# Altium schematic sheet E73-2G4M04S_breakout_sch.SchDoc: E73-2G4M04S Breakout Board
size A4; Author: Zisis Adamos; Engineer: Zisis Adamos; Revision: 1.0
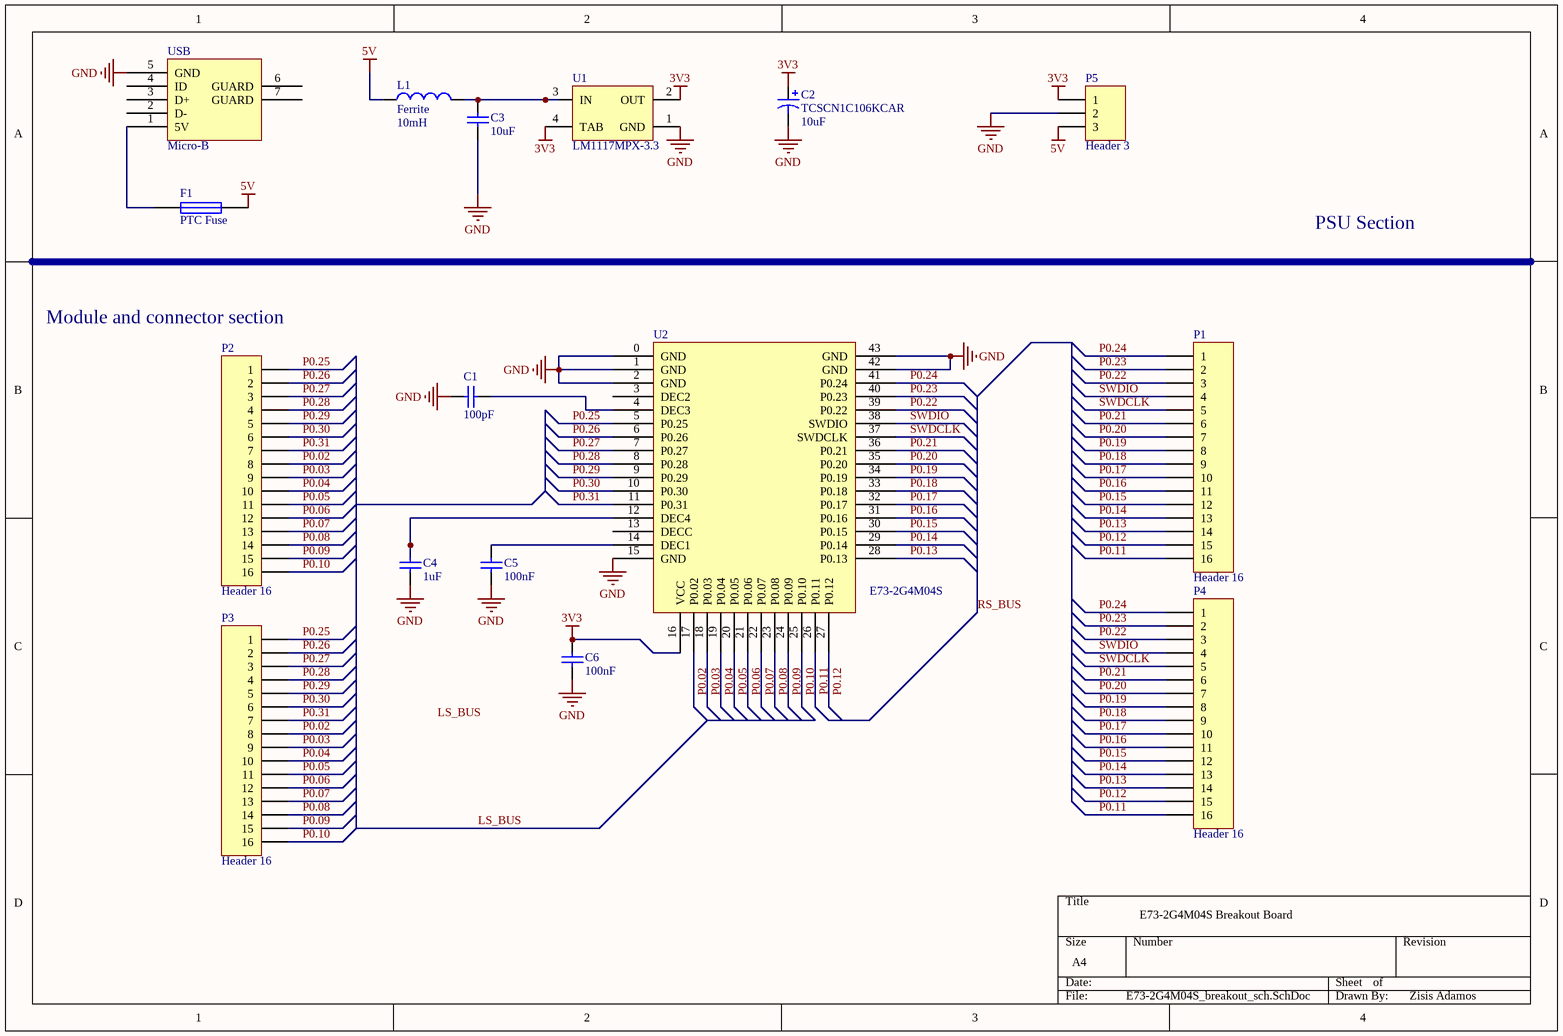
[diagram p0: E73-2G4M04S_breakout_sch.SchDoc]

## Parts
C1  value 100pF  [6-0805_N]  (hidden comment: Cap)
C2  TCSCN1C106KCAR  value 10uF  [C]
C3  value 10uF  [6-0805_N]  (hidden comment: Cap)
C4  value 1uF  [6-0805_N]  (hidden comment: Cap)
C5  value 100nF  [6-0805_N]  (hidden comment: Cap)
C6  value 100nF  [6-0805_N]  (hidden comment: Cap)
F1  PTC Fuse  [1210]
L1  Ferrite  value 10mH  [6-0805_n]
P1  Header 16  [HDR1X16]
P2  Header 16  [HDR1X16]
P3  Header 16  [HDR1X16]
P4  Header 16  [HDR1X16]
P5  Header 3  [HDR1X3]
U1  LM1117MPX-3.3  [MP04A_N]
U2  E73-2G4M04S  [E73-2G4M04S]
USB  Micro-B  [USB_2_MICRO_B]

## Nets
3V3: C2.1 C6.1 P5.1 U1.2(OUT) U1.4(TAB) U2.16(VCC)
5V: F1.2 L1.1 P5.3
GND: C1.1 C2.2 C3.1 C4.2 C5.2 C6.2 P5.2 U1.1(GND) U2.0(GND) U2.1(GND) U2.2(GND) U2.15(GND) U2.42(GND) U2.43(GND) USB.5(GND)
P0.02: P2.8 P3.8 U2.17(P0.02)
P0.03: P2.9 P3.9 U2.18(P0.03)
P0.04: P2.10 P3.10 U2.19(P0.04)
P0.05: P2.11 P3.11 U2.20(P0.05)
P0.06: P2.12 P3.12 U2.21(P0.06)
P0.07: P2.13 P3.13 U2.22(P0.07)
P0.08: P2.14 P3.14 U2.23(P0.08)
P0.09: P2.15 P3.15 U2.24(P0.09)
P0.10: P2.16 P3.16 U2.25(P0.10)
P0.11: P1.16 P4.16 U2.26(P0.11)
P0.12: P1.15 P4.15 U2.27(P0.12)
P0.13: P1.14 P4.14 U2.28(P0.13)
P0.14: P1.13 P4.13 U2.29(P0.14)
P0.15: P1.12 P4.12 U2.30(P0.15)
P0.16: P1.11 P4.11 U2.31(P0.16)
P0.17: P1.10 P4.10 U2.32(P0.17)
P0.18: P1.9 P4.9 U2.33(P0.18)
P0.19: P1.8 P4.8 U2.34(P0.19)
P0.20: P1.7 P4.7 U2.35(P0.20)
P0.21: P1.6 P4.6 U2.36(P0.21)
P0.22: P1.3 P4.3 U2.39(P0.22)
P0.23: P1.2 P4.2 U2.40(P0.23)
P0.24: P1.1 P4.1 U2.41(P0.24)
P0.25: P2.1 P3.1 U2.5(P0.25)
P0.26: P2.2 P3.2 U2.6(P0.26)
P0.27: P2.3 P3.3 U2.7(P0.27)
P0.28: P2.4 P3.4 U2.8(P0.28)
P0.29: P2.5 P3.5 U2.9(P0.29)
P0.30: P2.6 P3.6 U2.10(P0.30)
P0.31: P2.7 P3.7 U2.11(P0.31)
SWDCLK: P1.5 P4.5 U2.37(SWDCLK)
SWDIO: P1.4 P4.4 U2.38(SWDIO)
NetC1_2: C1.2 U2.4(DEC3)
NetC3_2: C3.2 L1.2 U1.3(IN)
NetC4_1: C4.1 U2.12(DEC4)
NetC5_1: C5.1 U2.14(DEC1)
NetF1_1: F1.1 USB.1(5V)

Not connected (* = marked no-connect by the designer): U2 3(DEC2) 13(DECC); USB 2(D-) 3(D+) 4(ID) 6(GUARD) 7(GUARD)

## Buses and harness runs
bus LS_BUS
bus RS_BUS

## Notes on the sheet
- PSU Section
- (near P2) Module and connector section
- Labels drawn without touching a wire or pin: LS_BUS

## Library data of the parts
C1 C3-C6 = Cap: Capacitor; Published: 8-Jun-2000; LatestRevisionDate: 17-Jul-2002; LatestRevisionNote: Re-released for DXP Platform.; PackageReference: RAD-0.3; Publisher: Altium Limited; PackageDescription: Radial Cap, Thru-Hole; 2 Leads; 0.3 in Pin Spacing
C2 = Cap Pol3: Polarized Capacitor (Surface Mount); Published: 8-Jun-2000; LatestRevisionDate: 29-May-2009; LatestRevisionNote: IPC-7351 Footprint Added.; PackageReference: C0805; Publisher: Altium Limited; PackageDescription: Chip Capacitor
F1 = Fuse 1: Fuse; Published: 8-Jun-2000; LatestRevisionDate: 17-Jul-2002; LatestRevisionNote: Re-released for DXP Platform.; PackageReference: PIN-W2/E2.8; Publisher: Altium Limited; PackageDescription: Thru-Hole; 2 Leads
L1 = Inductor: Code_IEC: 1005; Published: 8-Jun-2000; LatestRevisionDate: 29-May-2009; LatestRevisionNote: IPC-7351 Footprint Added.; PackageReference: 0402-A; Publisher: Altium Limited; PackageDescription: Chip Inductor; Code_JEITA: 0402
P1-P4 = Header 16: Header, 16-Pin; LatestRevisionDate: 17-Jul-2002; LatestRevisionNote: Re-released for DXP Platform.; Publisher: Altium Limited
P5 = Header 3: Header, 3-Pin; LatestRevisionDate: 17-Jul-2002; LatestRevisionNote: Re-released for DXP Platform.; Publisher: Altium Limited
U1 = LM1117MPX-3.3: 800mA Low-Dropout Linear Regulator, 4-pin SOT-223; Manufacturer: National Semiconductor; PackageTopMarking: XYTT*N05A; PowerWise: N; CompType: LDO IC; High-Reliability: Y; DatasheetVersion: Apr-2006; PackageVersion: revB, Apr-2003; PackageReference: MP04A; PackageDescription: Molded SOT-223, 6.50 x 3.56 x 1.6mm Body, 4 Lead, 2.3mm Pitch; PartNumber: LM1117MPX-3.3; RoHS: N; PinCount: 4; Code_JEDEC: TO-261-AA; Code_IPC: SOT223-4; ComponentLink1Description: Manufacturer URL; ComponentLink1URL: http://www.national.com/; ComponentLink2Description: LM1117 Datasheet; ComponentLink2URL: http://www.national.com/ds/LM/LM1117.pdf; ComponentLink3Description: LM1117 Web Page; ComponentLink3URL: http://www.national.com/pf/LM/LM1117.html; ComponentLink4Description: MP04A Package Page; ComponentLink4URL: http://www.national.com/packaging/folders/mp04a.html
U2 = E73-2G4M04S: nRF52832 2.4GHz Transceiver Wireless rf Module
USB = USB_MICRO_B: Generic USB Micro-B connector SMT